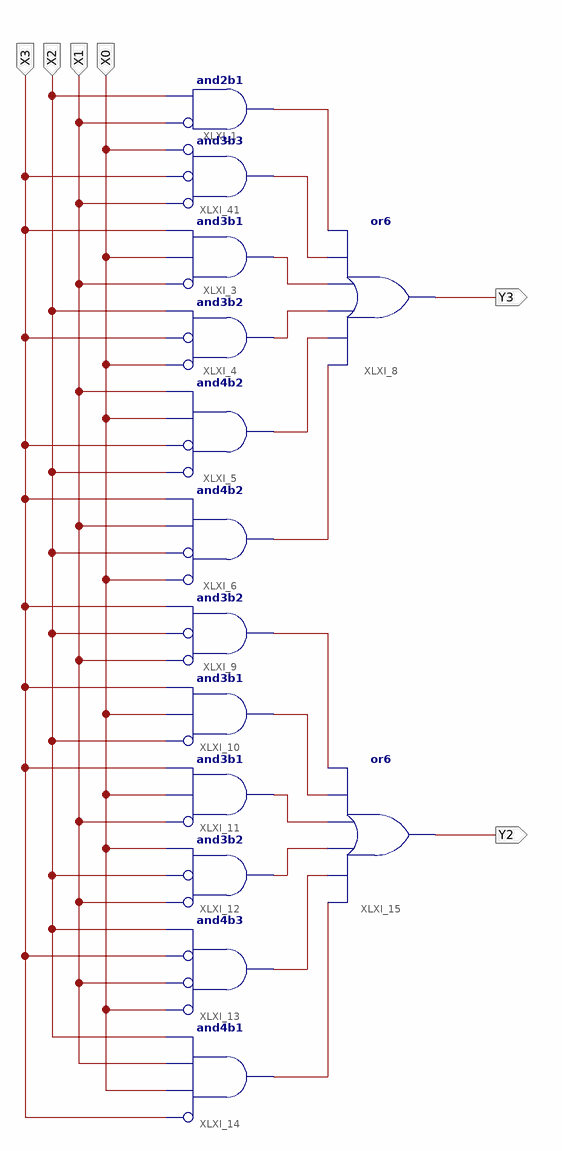
[diagram p0: schematic sheet 1]
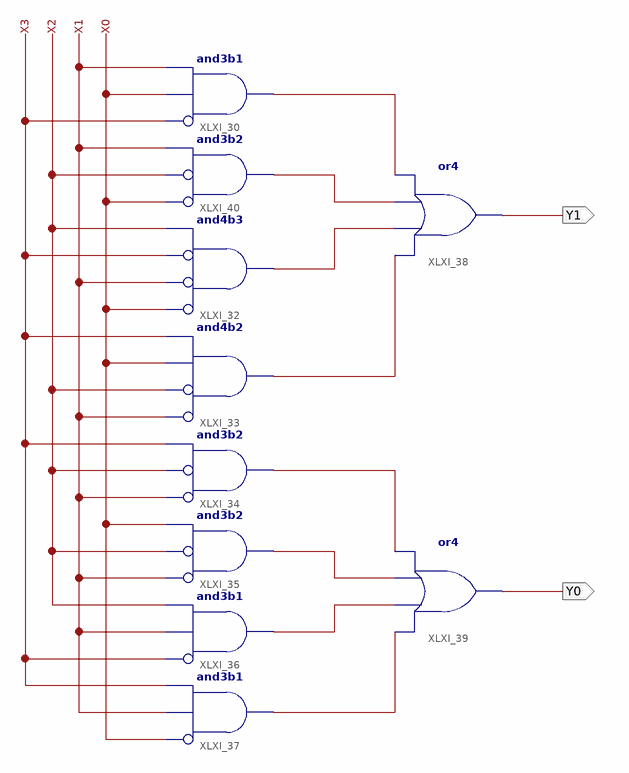
[diagram p1: schematic sheet 2]
// Xilinx ISE schematic LR1_DNF.sch (artix7) as structural Verilog: 24 symbols, 8 ports
module LR1_DNF (
  input  X3,
  input  X1,
  input  X0,
  input  X2,
  output Y3,
  output Y2,
  output Y1,
  output Y0
);

  wire XLXN_29, XLXN_33, XLXN_34, XLXN_35, XLXN_36, XLXN_37, XLXN_50, XLXN_51, XLXN_52, XLXN_53, XLXN_54,
       XLXN_55, XLXN_85, XLXN_86, XLXN_87, XLXN_89, XLXN_90, XLXN_91, XLXN_92, XLXN_93;

  and XLXI_1 (XLXN_29, ~X1, X2);  // and2b1
  and XLXI_3 (XLXN_34, ~X1, X0, X3);  // and3b1
  and XLXI_4 (XLXN_35, ~X0, ~X3, X2);  // and3b2
  and XLXI_5 (XLXN_36, ~X2, ~X3, X0, X1);  // and4b2
  and XLXI_6 (XLXN_37, ~X0, ~X2, X1, X3);  // and4b2
  or XLXI_8 (Y3, XLXN_37, XLXN_36, XLXN_35, XLXN_34, XLXN_33, XLXN_29);
  and XLXI_9 (XLXN_51, ~X1, ~X2, X3);  // and3b2
  and XLXI_10 (XLXN_52, ~X2, X0, X3);  // and3b1
  and XLXI_11 (XLXN_50, ~X1, X0, X3);  // and3b1
  and XLXI_12 (XLXN_53, ~X1, ~X2, X0);  // and3b2
  and XLXI_13 (XLXN_55, ~X0, ~X1, ~X3, X2);  // and4b3
  and XLXI_14 (XLXN_54, ~X3, X0, X1, X2);  // and4b1
  or XLXI_15 (Y2, XLXN_54, XLXN_55, XLXN_53, XLXN_50, XLXN_52, XLXN_51);
  and XLXI_30 (XLXN_85, ~X3, X0, X1);  // and3b1
  and XLXI_32 (XLXN_87, ~X0, ~X1, ~X3, X2);  // and4b3
  and XLXI_33 (XLXN_89, ~X1, ~X2, X0, X3);  // and4b2
  and XLXI_34 (XLXN_90, ~X1, ~X2, X3);  // and3b2
  and XLXI_35 (XLXN_91, ~X1, ~X2, X0);  // and3b2
  and XLXI_36 (XLXN_92, ~X3, X1, X2);  // and3b1
  and XLXI_37 (XLXN_93, ~X0, X1, X3);  // and3b1
  or XLXI_38 (Y1, XLXN_89, XLXN_87, XLXN_86, XLXN_85);
  or XLXI_39 (Y0, XLXN_93, XLXN_92, XLXN_91, XLXN_90);
  and XLXI_40 (XLXN_86, ~X0, ~X2, X1);  // and3b2
  and XLXI_41 (XLXN_33, ~X1, ~X3, ~X0);  // and3b3
endmodule
